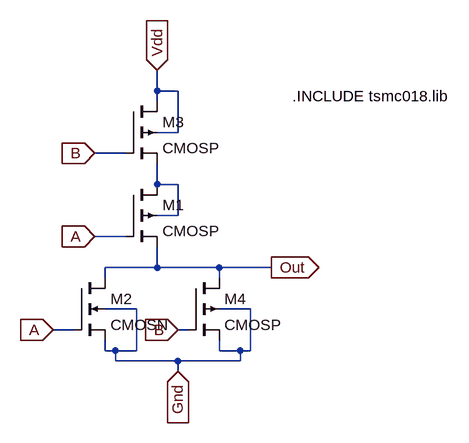
[diagram p0: schematic NOR.asc]
NOR.asc, the LTspice schematic file:
Version 4
SHEET 1 880 680
WIRE 144 -80 144 -112
WIRE 176 -80 144 -80
WIRE 144 -64 144 -80
WIRE 176 -16 176 -80
WIRE 176 -16 144 -16
WIRE 96 16 48 16
WIRE 144 64 144 32
WIRE 176 64 144 64
WIRE 176 112 176 64
WIRE 176 112 144 112
WIRE 96 144 48 144
WIRE 144 192 144 160
WIRE 144 192 64 192
WIRE 240 192 144 192
WIRE 320 192 240 192
WIRE 64 208 64 192
WIRE 240 208 240 192
WIRE 112 256 64 256
WIRE 288 256 240 256
WIRE 16 288 -16 288
WIRE 192 288 176 288
WIRE 64 320 64 304
WIRE 80 320 64 320
WIRE 112 320 112 256
WIRE 112 320 80 320
WIRE 240 320 240 304
WIRE 272 320 240 320
WIRE 288 320 288 256
WIRE 288 320 272 320
WIRE 80 336 80 320
WIRE 176 336 80 336
WIRE 272 336 272 320
WIRE 272 336 176 336
WIRE 176 352 176 336
FLAG 176 352 Gnd
IOPIN 176 352 In
FLAG -16 288 A
IOPIN -16 288 In
FLAG 48 144 A
IOPIN 48 144 In
FLAG 176 288 B
IOPIN 176 288 In
FLAG 48 16 B
IOPIN 48 16 In
FLAG 320 192 Out
IOPIN 320 192 Out
FLAG 144 -112 Vdd
IOPIN 144 -112 In
SYMBOL cmosp 96 64 R0
SYMATTR InstName M1
SYMATTR Value2 l=180n w=1600n
SYMBOL cmosn 16 208 R0
SYMATTR InstName M2
SYMATTR Value2 l=180n w=400n
SYMBOL cmosp 96 -64 R0
SYMATTR InstName M3
SYMATTR Value2 l=180n w=1600n
SYMBOL cmosp 192 208 R0
SYMATTR InstName M4
SYMATTR Value2 l=180n w=400n
TEXT 352 -72 Left 2 !.INCLUDE tsmc018.lib

The netlist it stands for:
* NOR.asc
M1 N001 A Out N001 CMOSP l=180n w=1600n
M2 Out A Gnd Gnd CMOSN l=180n w=400n
M3 Vdd B N001 Vdd CMOSP l=180n w=1600n
M4 Out B Gnd Gnd CMOSP l=180n w=400n
.model NMOS NMOS
.model PMOS PMOS
.lib standard.mos
.INCLUDE tsmc018.lib
.backanno
.end